# Altium schematic sheet Motor_Driver.SchDoc
size A4; SheetNumber: 2; SheetTotal: 4
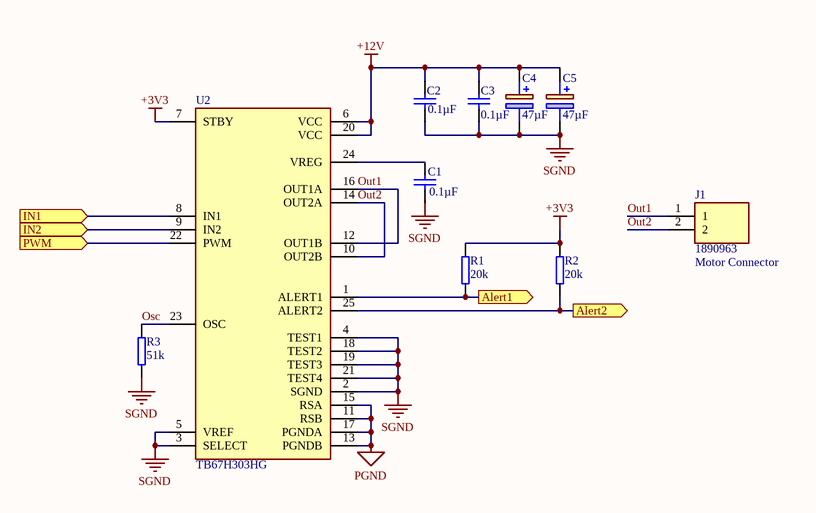
[diagram p0: Motor_Driver.SchDoc]

## Parts
C1  0.1µF  [Capacitor 0603]
C2  0.1µF  [Capacitor 0603]
C3  0.1µF  [Capacitor 0603]
C4  47µF  [CAPAE660X550N]
C5  47µF  [CAPAE660X550N]
J1  1890963  [1890963]
R1  20k  [Resistor 0603]
R2  20k  [Resistor 0603]
R3  51k  [Resistor 0603]
U2  TB67H303HG  [TO100P2930X465X1937-25]

## Ports
Alert1 (out, see Main_Board_Tank[4A]), Alert2 (out, see Main_Board_Tank[4A]), IN1 (in, see Main_Board_Tank[4A]), IN2 (in, see Main_Board_Tank[4A]), PWM (in, see Main_Board_Tank[4A])

## Nets
+3V3: R1.2 R2.2 U2.7(STBY)
+12V: C2.1 C3.1 C4.1(+) C5.1(+) U2.6(VCC) U2.20(VCC)
PGND: U2.11(RSB) U2.13(PGNDB) U2.15(RSA) U2.17(PGNDA)
SGND: C1.2 C2.2 C3.2 C4.2(-) C5.2(-) R3.1 U2.2(SGND) U2.3(SELECT) U2.4(TEST1) U2.5(VREF) U2.18(TEST2) U2.19(TEST3) U2.21(TEST4)
Alert1: R1.1 U2.1(ALERT1) ; port Alert1
Alert2: R2.1 U2.25(ALERT2) ; port Alert2
IN1: U2.8(IN1) ; port IN1
IN2: U2.9(IN2) ; port IN2
Osc: R3.2 U2.23(OSC)
Out1: J1.1 U2.12(OUT1B) U2.16(OUT1A)
Out2: J1.2 U2.10(OUT2B) U2.14(OUT2A)
PWM: U2.22(PWM) ; port PWM
NetC1_1: C1.1 U2.24(VREG)

## Notes on the sheet
- (near J1) Motor Connector

## Library data of the parts
C1-C3 = Capacitor 0603: Capacitor
C4 C5 = 865080543009: Wurth Elektronik 47uF 35 V dc Aluminium Electrolytic Capacitor, WCAP-ASLI Series 2000h 6.3 (Dia.) x 5.35mm; Geometry.Height: 5.5mm; Mouser Part Number: 710-865080543009; Mouser Price/Stock: https://www.mouser.co.uk/ProductDetail/Wurth-Elektronik/865080543009?qs=0KOYDY2FL2%2F%252BYmhMLtEhDQ%3D%3D; Manufacturer_Name: Wurth Elektronik; Manufacturer_Part_Number: 865080543009; Datasheet Link: https://katalog.we-online.de/pbs/datasheet/865080543009.pdf
J1 = 1890963: Connector: 2pin screw terminal; Manufacturer_Name: Phoenix Contact; Datasheet Link: http://www.phoenixcontact.com/de/produkte/1890963/pdf; Height: 15.15mm; Manufacturer_Part_Number: 1890963; Mouser Part Number: 651-1890963; Mouser Price/Stock: https://www.mouser.co.uk/ProductDetail/Phoenix-Contact/1890963?qs=5W%252BNKB25SvKX6KIA0xFJOA%3D%3D; Arrow Part Number: 1890963; Arrow Price/Stock: https://www.arrow.com/en/products/1890963/phoenix-contact?region=nac
R1-R3 = Resistor 0603: Resistor
U2 = TB67H303HG: Full Bridge